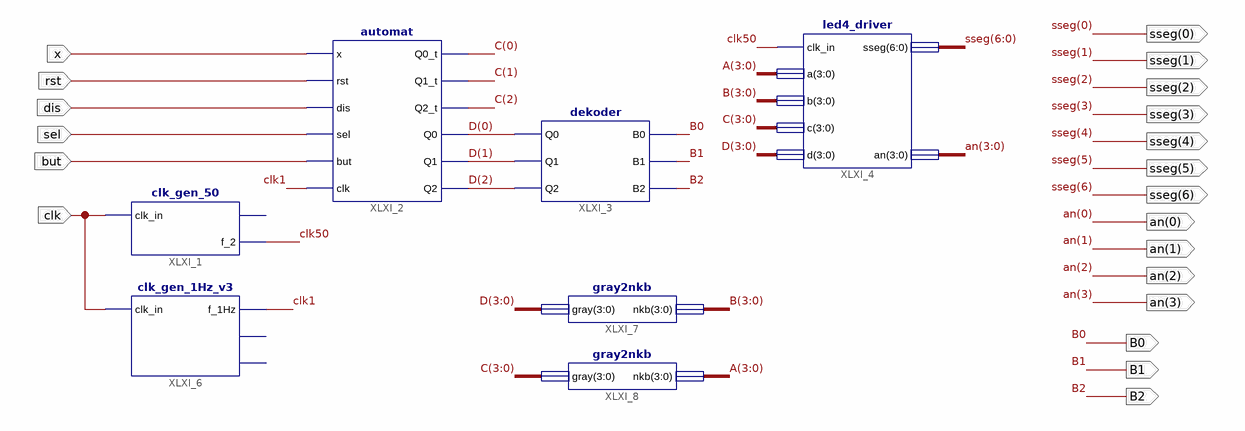
[diagram p0: schematic sheet 1]
// Xilinx ISE schematic symulacja.sch (spartan3e) as structural Verilog: 7 symbols, 20 ports
module symulacja (
  input  clk,
  input  but,
  input  sel,
  input  dis,
  input  rst,
  input  x,
  output [6:0] sseg,
  output [3:0] an,
  output B0,
  output B1,
  output B2
);

  wire clk1, clk50;
  wire [3:0] A, B, C, D;

  led4_driver XLXI_4 (.clk_in(clk50), .a(A), .b(B), .c(C), .d(D), .sseg(sseg), .an(an));
  clk_gen_50 XLXI_1 (.clk_in(clk), .f_2(clk50));  // open: f_1
  automat XLXI_2 (
    .x(x), .rst(rst), .dis(dis), .sel(sel), .but(but), .clk(clk1), .Q0_t(C[0]), .Q1_t(C[1]), .Q2_t(C[2]),
    .Q2(D[2]), .Q1(D[1]), .Q0(D[0]));
  clk_gen_1Hz_v3 XLXI_6 (.clk_in(clk), .f_1Hz(clk1));  // open: f_1kHz, f_1MHz
  gray2nkb XLXI_7 (.gray(D), .nkb(B));
  gray2nkb XLXI_8 (.gray(C), .nkb(A));
  dekoder XLXI_3 (.Q2(D[2]), .Q0(D[0]), .Q1(D[1]), .B2(B2), .B1(B1), .B0(B0));

  // Notes on the sheet:
  //   LOC on signal sseg(0) = L18
  //   LOC on signal sseg(2) = D17
  //   LOC on signal sseg(3) = D16
  //   LOC on signal sseg(4) = G14
  //   LOC on signal sseg(5) = J17
  //   LOC on signal sseg(6) = H14
  //   LOC on signal an(0) = F17
  //   LOC on signal an(1) = H17
  //   LOC on signal an(2) = C18
  //   LOC on signal an(3) = F15
  //   LOC on signal sseg(1) = F18
  //   LOC on signal clk = B8
  //   LOC on signal but = B18
  //   LOC on signal sel = G18
  //   LOC on signal dis = H18
  //   LOC on signal rst = H13
  //   LOC on signal x = R17
  //   LOC on signal B0 = J14
  //   LOC on signal B1 = J15
  //   LOC on signal B2 = K15
endmodule
